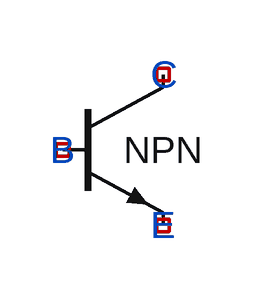
[diagram p0: schematic 1.asc]
1.asc, the LTspice schematic file:
Version 4
SHEET 1 880 680
SYMBOL npn 160 96 R0
WINDOW 0 39 48 Left 2
SYMATTR InstName NPN
SYMATTR Value ""
TEXT 216 96 Left 2 ;C
TEXT 216 192 Left 2 ;E
TEXT 152 144 Left 2 ;B

The netlist it stands for:
* 1.asc
Q§NPN NC_01 NC_02 NC_03 0
.model NPN NPN
.model PNP PNP
.lib standard.bjt
* C
* E
* B
.backanno
.end